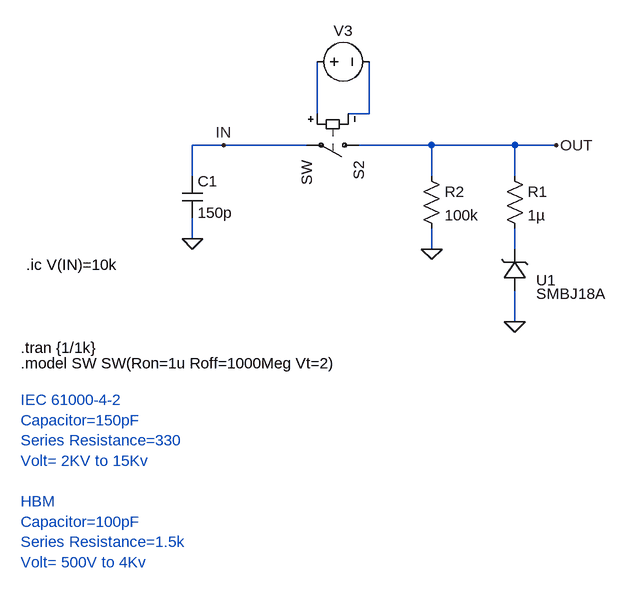
[diagram p0: schematic ESD.asc]
ESD.asc, the LTspice schematic file:
Version 4.1
SHEET 1 956 808
WIRE 336 128 336 48
WIRE 416 128 416 48
WIRE 416 128 384 128
WIRE 192 176 144 176
WIRE 320 176 192 176
WIRE 512 176 400 176
WIRE 640 176 512 176
WIRE 704 176 640 176
WIRE 144 224 144 176
WIRE 512 224 512 176
WIRE 640 224 640 176
WIRE 144 320 144 288
WIRE 512 336 512 304
WIRE 640 336 640 304
WIRE 640 448 640 400
FLAG 144 320 0
FLAG 640 448 0
FLAG 704 176 OUT
FLAG 192 176 IN
FLAG 512 336 0
SYMBOL cap 128 224 R0
SYMATTR InstName C1
SYMATTR Value 150p
SYMATTR SpiceLine Rser=330
SYMBOL res 624 208 R0
SYMATTR InstName R1
SYMATTR Value 1µ
SYMBOL MyLib\\Diode_TVS\\_TVS_Zetex_A 624 400 M180
WINDOW 38 49 -5 Left 2
SYMATTR InstName U1
SYMBOL sw 416 176 R90
SYMATTR InstName S2
SYMBOL voltage 320 48 R270
WINDOW 0 32 56 VTop 2
WINDOW 3 -32 56 Invisible 2
WINDOW 123 0 0 Left 0
WINDOW 39 0 0 Left 0
SYMATTR InstName V3
SYMATTR Value PULSE(0 2 {0.2/1k} 1n 1n {0.02/1k} {1/1k})
SYMBOL res 496 208 R0
SYMATTR InstName R2
SYMATTR Value 100k
TEXT -120 512 Left 2 !.model SW SW(Ron=1u Roff=1000Meg Vt=2)
TEXT -120 488 Left 2 !.tran {1/1k}
TEXT -120 568 Left 2 ;IEC 61000-4-2\nCapacitor=150pF\nSeries Resistance=330\nVolt= 2KV to 15Kv\n \nHBM\nCapacitor=100pF\nSeries Resistance=1.5k\nVolt= 500V to 4Kv
TEXT -112 360 Left 2 !.ic V(IN)=10k

The netlist it stands for:
* ESD.asc
C1 IN 0 150p Rser=330
R1 OUT N003 1µ
X§U1 0 N003 SMBJ18A  ; pins + -
S2 OUT IN N001 N002 SW
V3 N001 N002 PULSE(0 2 {0.2/1k} 1n 1n {0.02/1k} {1/1k})
R2 OUT 0 100k
.model SW SW(Ron=1u Roff=1000Meg Vt=2)
.tran {1/1k}
* IEC 61000-4-2
* Capacitor=150pF
* Series Resistance=330
* Volt= 2KV to 15Kv
* HBM
* Capacitor=100pF
* Series Resistance=1.5k
* Volt= 500V to 4Kv
.ic V(IN)=10k
.lib MyLib/Diode_TVS/_TVS_Zetex.lib
.backanno
.end